# Altium project LOGi-SDR.PrjPcb
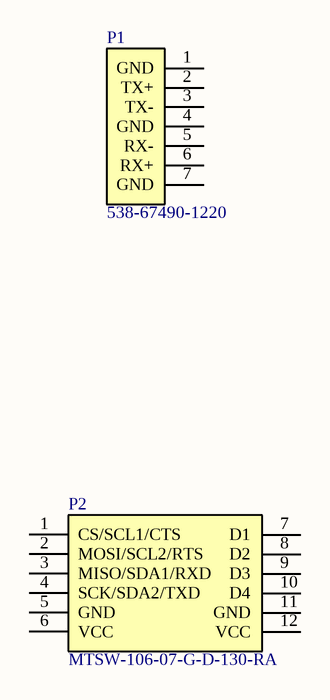
[diagram p0: LOGi-SDR.SchDoc]
1 sheet, 2 parts. Net scope: global (net labels, ports and power ports of the same name join across sheets).
Board file: LOGi-SDR.PcbDoc

## Sheet LOGi-SDR.SchDoc: LOGi SDR Future
size A; Engineer: M. Jones; Organization: Michael Jones; Revision: RA.1; SheetNumber: 1; SheetTotal: 1

### Parts
P1  Supplier Part Number 1: 538-67490-1220  [SATA - 67490-3220]  (hidden comment: SATA - 67490-1220)
P2  MTSW-106-07-G-D-130-RA  [PMOD HEADER - Male]

### Nets

Not connected (* = marked no-connect by the designer): P1 1(GND) 2(TX+) 3(TX-) 4(GND) 5(RX-) 6(RX+) 7(GND); P2 1(CS/SCL1/CTS) 2(MOSI/SCL2/RTS) 3(MISO/SDA1/RXD) 4(SCK/SDA2/TXD) 5(GND) 6(VCC) 7(D1) 8(D2) 9(D3) 10(D4) 11(GND) 12(VCC)

### Notes on the sheet
- Title
- Revision:
- Sheet
- of
- Date:
- Engineer:

### Library data of the parts
P1 = SATA - 67490-1220: SATA Data - 67490-1220; Manufacturer: Molex; 1Notes: looks more standard need, different footprint; Description: I/O Connectors SERIAL ATA SGNAL PLG lead free; Gender: Male; Pitch: 1.27 mm; Number of Positions / Contacts: 7; Supplier 1: Mouser; Manufacturer Part Number: 67490-1220; RoHS: RoHS Compliant; Category: I/O Connectors; Stock 1: 475; Pricing 1: 1=1.28, 10=1.07, 100=0.792, 500=0.640, 1000=0.572, 2000=0.525 (AUD); Packaging: Tray; Product: SATA Connectors; Termination Style: Solder Terminal; Mounting Style: SMD/SMT; Product Category: 1.27mm Connectors; Standard Pack Qty: 2880; RoHS - Mouser: Y; Minimum Order Quantity: 1; Reeling: False; ComponentLink1URL: http://www.molex.com/webdocs/datasheets/pdf/en-us/0674901220_PCB_HEADERS.pdf; ComponentLink1Description: http://www.molex.com/webdocs/datasheets/pdf/en-us/0674901220_PCB_HEADERS.pdf
P2 = P-MOD - MTSW-106-07-G-D-130-RA: Samtec Male Conn Unshrouded Header HDR 12 POS 2.54mm Solder RA Thru-Hole; Lead Time: 0 weeks; Peak Solder Temperature: 260 deg C; MSL (Moisture Sensitivity Level): N/R; Supplier 1: Arrow; Manufacturer: Samtec; Manufacturer Part Number: MTSW-106-07-G-D-130-RA; RoHS: CHINA ROHS: Compliant / EU ROHS: Compliant; Description: Conn Unshrouded Header HDR 12 POS 2.54mm Solder RA Thru-Hole; Stock 1: 0; Termination Finish: Au/Ni; China ROHS Lead (X -> above / O -> below threshold): O; China ROHS Mercury (X -> above / O -> below threshold): O; China ROHS Cadmium (X -> above / O -> below threshold): O; China ROHS Hex Chromium (X -> above / O -> below threshold): O; China ROHS PBB (X -> above / O -> below threshold): O; China ROHS PBDE (X -> above / O -> below threshold): O; EU_ROHS_PROD_EXEMPTION_BY_SUPP: N/R; ComponentLink1URL: http://components.arrow.com/partservice/dataview/altium/2717179?apiKey=aa438727d59eed98c4bed826d8d949c84cb5e685b92bf87346a0226bd2658797; ComponentLink1Description: http://components.arrow.com/partservice/dataview/altium/2717179?apiKey=aa438727d59eed98c4bed826d8d949c84cb5e685b92bf87346a0226bd2658797; Supplier Part Number 1: 2717179; =Value: MTSW-106-07-G-D-130-RA; Value: MTSW-106-07-G-D-130-RA